# EAGLE design ledSkateBoard (EAGLE 7.2.0)
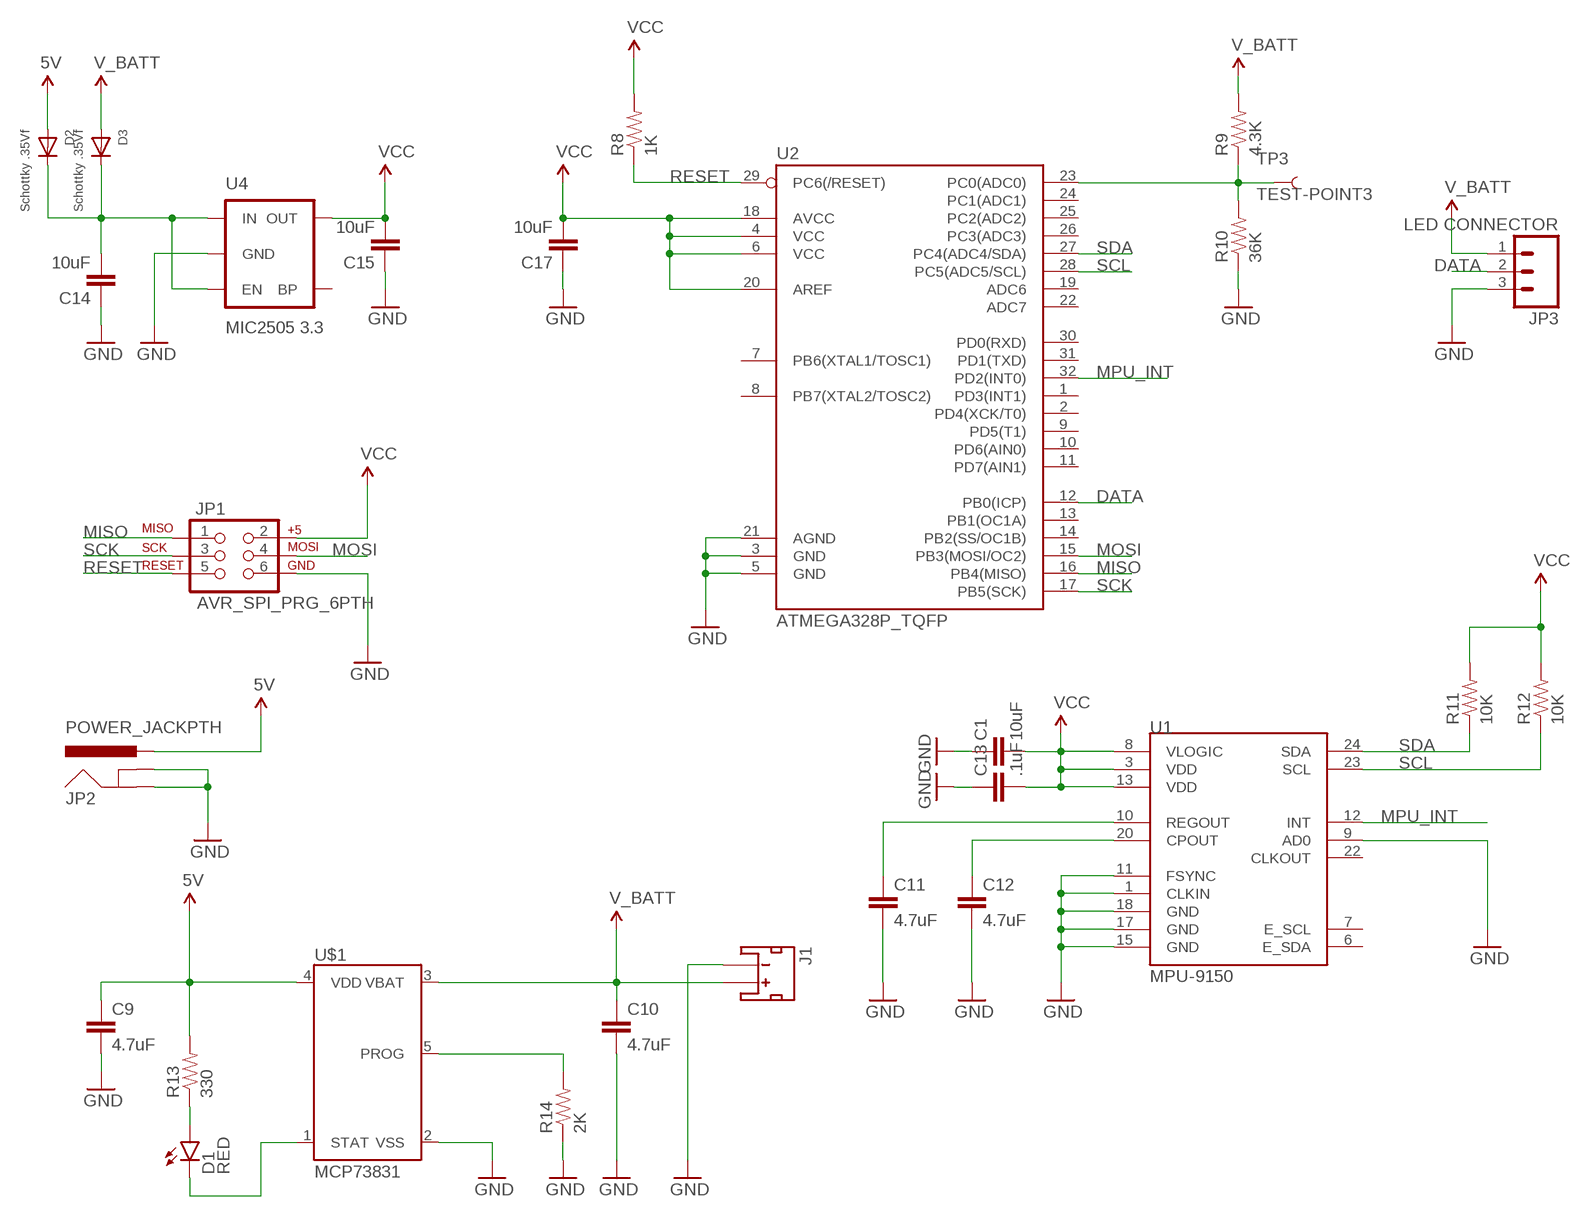
[diagram p0: schematic, sheet 1]

## Parts
C1  10uF  CAP0805  [0805]
C9  4.7uF  CAP0805  [0805]
C10  4.7uF  CAP0805  [0805]
C11  4.7uF  CAP0805  [0805]
C12  4.7uF  CAP0805  [0805]
C13  .1uF  CAP0805  [0805]
C14  10uF  CAP0805  [0805]
C15  10uF  CAP0805  [0805]
C17  10uF  CAP0805  [0805]
D1  RED  LED-RED0603  [LED-0603]
D2  Schottky .35Vf  DIODESMA  [SMADIODE]
D3  Schottky .35Vf  DIODESMA  [SMADIODE]
J1  JST  JST_2MM_MALE  [JST-2-SMD]
JP1  AVR_SPI_PRG_6PTH  [2X3]
JP2  POWER_JACKPTH  [POWER_JACK_PTH]
JP3  LED CONNECTOR  M03PTH  [1X03]
R8  1K  RESISTOR0805-RES  [0805]
R9  4.3K  RESISTOR0805-RES  [0805]
R10  36K  RESISTOR0805-RES  [0805]
R11  10K  RESISTOR0805-RES  [0805]
R12  10K  RESISTOR0805-RES  [0805]
R13  330  RESISTOR0805-RES  [0805]
R14  2K  RESISTOR0805-RES  [0805]
TP3  TEST-POINT3  [PAD.03X.03]
U1  MPU-9150  MPU-9150QFN-24-NP  [QFN-24-NP]
U2  ATMEGA328P_TQFP  [TQFP32-08]
U4  MIC2505 3.3  MIC52053.3V  [SOT23-5]
U$1  MCP73831  [SOT23-5]

## Nets
5V: C9.1 D2.A JP2.PWR R13.2 U$1.4(VDD)
DATA: JP3.2 U2.12(PB0(ICP))
GND: C1.1 C9.2 C10.2 C11.2 C12.2 C13.1 C14.1 C15.1 C17.1 J1.1(-) JP1.6 JP2.GND JP2.GNDBREAK JP3.3 R10.1 R14.1 U1.1(CLKIN) U1.9(AD0) U1.11(FSYNC) U1.15(GND) U1.17(GND) U1.18(GND) U2.3(GND) U2.5(GND) U2.21(AGND) U4.2(GND) U$1.2(VSS)
MISO: JP1.1 U2.16(PB4(MISO))
MOSI: JP1.4 U2.15(PB3(MOSI/OC2))
MPU_INT: U1.12(INT) U2.32(PD2(INT0))
N$1: C11.1 U1.10(REGOUT)
N$2: C12.1 U1.20(CPOUT)
N$3: C14.2 D2.C D3.C U4.1(IN) U4.3(EN)
N$4: R9.1 R10.2 TP3.P$1 U2.23(PC0(ADC0))
N$7: D1.A R13.1
N$8: D1.C U$1.1(STAT)
N$11: R14.2 U$1.5(PROG)
RESET: JP1.5 R8.1 U2.29(PC6(/RESET))
SCK: JP1.3 U2.17(PB5(SCK))
SCL: R12.1 U1.23(SCL) U2.28(PC5(ADC5/SCL))
SDA: R11.1 U1.24(SDA) U2.27(PC4(ADC4/SDA))
V_BATT: C10.1 D3.A J1.2(+) JP3.1 R9.2 U$1.3(VBAT)
VCC: C1.2 C13.2 C15.2 C17.2 JP1.2 R8.2 R11.2 R12.2 U1.3(VDD) U1.8(VLOGIC) U1.13(VDD) U2.4(VCC) U2.6(VCC) U2.18(AVCC) U2.20(AREF) U4.5(OUT)
Unconnected: J1.NC1(PAD1) J1.NC2(PAD2) U1.6(E_SDA) U1.7(E_SCL) U1.22(CLKOUT) U2.1(PD3(INT1)) U2.2(PD4(XCK/T0)) U2.7(PB6(XTAL1/TOSC1)) U2.8(PB7(XTAL2/TOSC2)) U2.9(PD5(T1)) U2.10(PD6(AIN0)) U2.11(PD7(AIN1)) U2.13(PB1(OC1A)) U2.14(PB2(SS/OC1B)) U2.19(ADC6) U2.22(ADC7) U2.24(PC1(ADC1)) U2.25(PC2(ADC2)) U2.26(PC3(ADC3)) U2.30(PD0(RXD)) U2.31(PD1(TXD)) U4.4(BP)

## Library data of the parts
C1 C9-C15 C17 = SparkFun-Capacitors:CAP: Capacitor Standard 0603 ceramic capacitor, and 0.1" leaded capacitor.
D1 = SparkFun-LED:LED-RED: Assorted Red LEDs LilyPad 1206- DIO-09912 1206- DIO-00809 0603- DIO-00819; PROD_ID: DIO-00819
D2 D3 = microbuilder:DIODE: Diode SMA Model Volts Amps Type Vf Vr Digikey # Notes SSA34-E3 40V 3A Schottky 480mV @ 3A 200uA @ 40V SSA34-E3/61TGITR-ND CDBA120-G 20V 1A Schottky 500mV @ 1A 500uA @ 20V 641-1014-6-ND REEL MBRA210 10V 2A Schottky 350mV @ 2A 700uA @ 10V MBRA210LT3 SOD-123 Model Volts Amps Type Vf Vr Order # Notes BAT54T1G 30V 200mA Schottky 800mV @ 200mA 2uA @ 25V BAT54T1GOSTR-ND B0530W 30V 500mA Schottky 430mV @ 500mA 130uA @ 30V B0530W-FDICT-ND REEL MBR120 1A 20V Schottky 340mV @ 1A MBR120VLSFT1GOSCT-ND SOD-323 Model Volts Amps Type Vf Vr Order # Notes PMEG2005EJ 20V 500mA Schottky 355mV @ 500mA 568-4110-1-ND ZLLS410 10V 570mA Schottky 380mV @ 570mA ZLLS410CT-ND 1N4148WS 75V 150mA Silicon/Simple 1V 1N4148WSFSCT-ND REEL SOD-523 Model Volts Amps Type Vf Vr Order # Notes BAT54XV2 30V 200mA Schottky 0.8V @ 100mA BAT54XV2CT-ND TB751S 30V 30mA Schottky RB751S-40TE61CT-ND SOT23-R/W (R = Solder Paste/Reflow Ovens, W = Hand-Soldering) Model Volts Amps Type Vf Vr Order # Notes BAT54FILM 40V 300mA Schottky 497-7162-1-ND
J1 = SparkFun-Connectors:JST_2MM_MALE: Mates to single-cell LiPo batteries. CONN-08352; PROD_ID: CONN-08352
JP1 = SparkFun-Connectors:AVR_SPI_PRG_6: AVR ISP 6 Pin This is the reduced ISP connector for AVR programming. Common on Arduino. This footprint will take up less PCB space and can be used with a 10-pin to 6-pin adapter such as SKU: BOB-08508 **Special note about "TEST_POINT" package. The stop mask is on the top side, so if you want your programming test points to be on the bottom of your board, make sure to place this package on the bottom side of the board. This also ensure that the orientation to program from the bottom side will be correct.
JP2 = SparkFun-Connectors:POWER_JACK: Power Jack This is the standard 5.5mm barrel jack for power. The PTH is the most common, proven, reliable, footprint. The Slot footprint only works if the mill layer is transmitted to the PCB fab house so be warned. Mating wall wart : TOL-00298 (and others); PROD_ID: CONN-08197
JP3 = SparkFun-Connectors:M03: Header 3 Standard 3-pin 0.1" header. Use with straight break away headers (SKU : PRT-00116), right angle break away headers (PRT-00553), swiss pins (PRT-00743), machine pins (PRT-00117), and female headers (PRT-00115). Molex polarized connector foot print use with SKU : PRT-08232 with associated crimp pins and housings.
R8-R14 = SparkFun-Resistors:RESISTOR: Resistor Basic schematic elements and footprints for 0603, 1206, and PTH resistors.
TP3 = SparkFun-Passives:TEST-POINT: Bare copper test points for troubleshooting or ICT
U1 = SparkFun-Sensors:MPU-9150: 9DOF (3mag, 3accel, 3rotat). I2C interface.
U2 = SparkFun-DigitalIC:ATMEGA328P_TQFP; PROD_ID: IC-09069
U4 = SparkFun-PowerIC:MIC5205: MIC5205 150mA vreg 3.3V - VREG-00822 5V - VREG-00823; PROD_ID: VREG-00822
U$1 = GeekAmmo:MCP73831: MCP73831 Miniature Single-Cell, Fully Integrated Li-Ion, Li-Polymer Charge Management Controllers The MCP73831/2 devices are highly advanced linear charge management controllers for use in spacelimited, cost-sensitive applications. http://ww1.microchip.com/downloads/en/DeviceDoc/20001984F.pdf

## Board
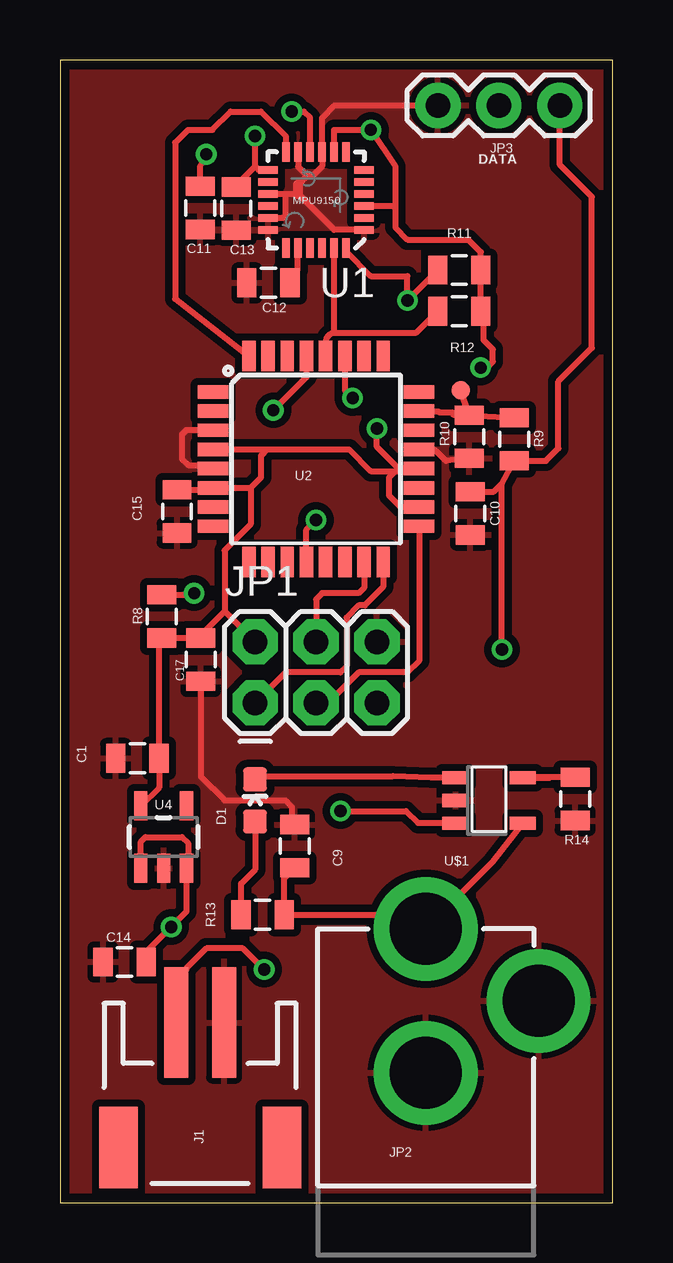
[diagram p1: board, top side]
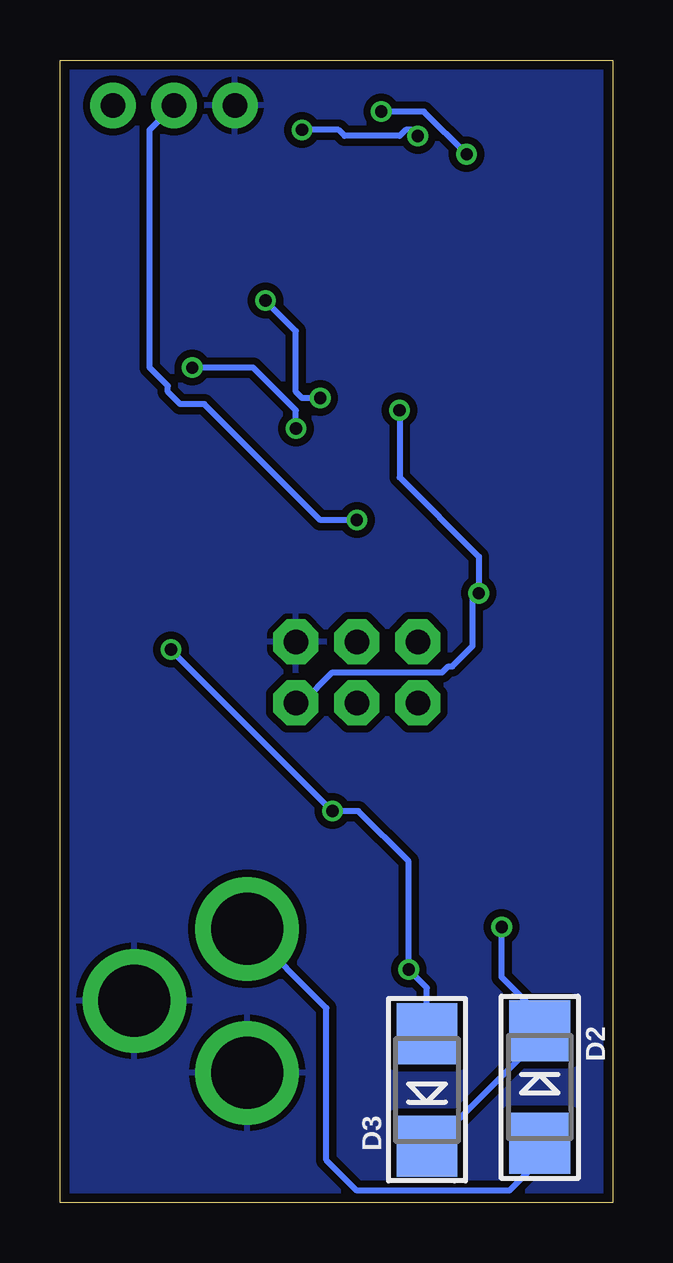
[diagram p2: board, bottom side, seen from below]

Size 23.04 x 47.62 mm. Coordinates in mm from the lower left corner, seen from the top.
Outline: 0,0 23.04,0 23.04,47.62 0,47.62 0,0
Copper layers (1*16): Top 0.0356mm / dielectric 1.5011mm / Bottom 0.0356mm
Design rules "OSHPARK": minimum track width 6mil, minimum drill 13mil, track to track 6mil, track to pad 6mil, pad to pad 6mil, via to via 6mil, smd to smd 6mil, copper to edge 15mil, drill to drill 6mil, minimum pad ring 7mil, minimum via ring 7mil, stop-mask expansion 3mil, vias tented up to drill 0mil, thermal gap 10mil

### Footprints (pad centres in the part's own frame; a part is rotated, then mirrored left to right if it is on the bottom)
0805 = smd 0.8 x 1.2: 1 -0.9,0; 2 0.9,0
LED-0603 = smd 1 x 1: A 0,-0.877; C 0,0.877
SMADIODE = smd 2.54 x 2.54: A 2.349,0; C -2.349,0
JST-2-SMD = smd 1 x 4.6: 1 -1,-3.7; 2 1,-3.7 | smd 1.6 x 3.4: NC1 -3.4,1.5; NC2 3.4,1.5
2X3 = drill 1.016 pad 1.88 octagon: 1 0,0; 2 0,2.54; 3 2.54,0; 4 2.54,2.54; 5 5.08,0; 6 5.08,2.54
POWER_JACK_PTH = drill 2.997 pad 4.318: GND 0,7.7; GNDBREAK 4.7,10.7; PWR 0,13.7
1X03 = drill 1.016 pad 1.88: 1 0,0; 2 2.54,0; 3 5.08,0
PAD.03X.03 = smd 0.762 x 0.762: P$1 0,0
QFN-24-NP = smd 0.8 x 0.3: 1 -2,1.25; 2 -2,0.75; 3 -2,0.25; 4 -2,-0.25; 5 -2,-0.75; 6 -2,-1.25; 13 2,-1.25; 14 2,-0.75; 15 2,-0.25; 16 2,0.25; 17 2,0.75; 18 2,1.25 | smd 0.3 x 0.8: 7 -1.25,-2; 8 -0.75,-2; 9 -0.25,-2; 10 0.25,-2; 11 0.75,-2; 12 1.25,-2; 19 1.25,2; 20 0.75,2; 21 0.25,2; 22 -0.25,2; 23 -0.75,2; 24 -1.25,2
TQFP32-08 = smd 1.27 x 0.559: 1 -4.293,2.8; 2 -4.293,2; 3 -4.293,1.2; 4 -4.293,0.4; 5 -4.293,-0.4; 6 -4.293,-1.2; 7 -4.293,-2; 8 -4.293,-2.8; 17 4.293,-2.8; 18 4.293,-2; 19 4.293,-1.2; 20 4.293,-0.4; 21 4.293,0.4; 22 4.293,1.2; 23 4.293,2; 24 4.293,2.8 | smd 0.559 x 1.27: 9 -2.8,-4.293; 10 -2,-4.293; 11 -1.2,-4.293; 12 -0.4,-4.293; 13 0.4,-4.293; 14 1.2,-4.293; 15 2,-4.293; 16 2.8,-4.293; 25 2.8,4.293; 26 2,4.293; 27 1.2,4.293; 28 0.4,4.293; 29 -0.4,4.293; 30 -1.2,4.293; 31 -2,4.293; 32 -2.8,4.293
SOT23-5 = smd 0.55 x 1.2: 1 -0.95,-1.3; 2 0,-1.3; 3 0.95,-1.3; 4 0.95,1.3; 5 -0.95,1.3
SOT23-5' = smd 0.55 x 1.1: 1 -0.95,-1.3; 2 0,-1.3; 3 0.95,-1.3; 4 0.95,1.5; 5 -0.95,1.5

### Placement (x,y rotation side)
C1  3.23,18.52 0 top
C9  9.78,14.86 90 top
C10  17.09,28.73 270 top
C11  5.84,41.45 270 top
C12  8.69,38.33 180 top
C13  7.34,41.43 90 top
C14  2.69,10.03 0 top
C15  4.88,28.8 90 top
C17  5.87,22.63 90 top
D1  8.13,16.76 0 top
D2  3.05,4.83 270 bottom
D3  7.75,4.7 90 bottom
J1  5.84,3.81 180 top
JP1  8.13,20.83 0 top
JP2  15.24,-2.29 0 top
JP3  20.83,45.72 180 top
R8  4.24,24.43 270 top
R9  18.92,31.81 270 top
R10  17.06,31.92 90 top
R11  16.64,38.86 0 top
R12  16.64,37.15 0 top
R13  8.45,12 0 top
R14  21.46,16.83 90 top
TP3  16.7,33.85 0 top
U1  10.67,41.78 180 top
U2  10.67,30.99 0 top
U4  4.32,15.24 0 top
U$1  MCP73831  [SOT23-5']  17.78,16.76 270 top

### Tracks (layer width: path | path; a pad name or v marks a point on that pad's centre or on a via)
5V
  Top 0.254: U$1.4 18.01,14.18 JP2.PWR 14.65,12 R13.2 9.35,13.53 C9.1
  Bottom 0.254: D2.A 3.05,1.78 4.32,0.51 10.67,0.51 11.94,1.78 11.94,8.11 JP2.PWR
DATA  (via drill 0.51)
  Top 0.254: U2.12 10.27,28.05 v10.67,28.45
  Bottom 0.254: v10.67,28.45 12.19,28.45 17.02,33.27 18.03,33.27 18.54,33.78 18.54,34.04 19.3,34.8 19.3,44.7 JP3.2
GND
  Top 0.254: 10.29,42.79 9.92,42.42 | U1.1 11.42,40.53 9.92,42.03 9.4,42.03 | U1.15 9.4,42.03 | U1.11 9.92,43.17 10.29,42.79 | 10.29,42.79 10.53,42.79 10.92,43.18 U1.9 10.92,45.21 11.43,45.72 JP3.3 | R10.1 16.08,30.91 15.62,31.37 14.98,31.37 U2.21 | C17.1 5.87,17.75 6.86,16.76 9.4,16.76 9.65,16.51 9.65,15.89 C9.2 | U1.17 9.28,41.03 9.4,41.15 9.4,42.03 | U2.3 5.26,32.19 5.08,32 5.08,30.99 5.33,30.73 6.23,30.73 U2.5
  Top 0.406: 9.92,42.03 9.92,42.42
  pour Top (isolate 0.305): 23.11,47.5 23.11,0 0,0 0,47.5
  pour Bottom (isolate 0.305): 0,47.5 23.11,47.5 23.11,0 0,0
MISO
  Top 0.254: U2.16 13.47,25.66 12.7,24.89 12.45,24.89 11.94,24.38 11.94,22.35 11.68,22.1 9.4,22.1 JP1.1
MOSI
  Top 0.254: U2.15 12.67,25.62 12.45,25.4 10.92,25.4 10.67,25.15 JP1.4
MPU_INT
  Top 0.254: U1.12 9.42,44.43 8.38,45.47 7.11,45.47 6.35,44.7 5.33,44.7 4.8,44.17 4.8,37.66 U2.32
N$1  (via drill 0.51)
  Top 0.254: U1.10 10.42,45.21 10.16,45.47 v9.65,45.47 | C11.1 5.84,43.18 v6.1,43.69
  Bottom 0.254: v6.1,43.69 7.87,45.47 v9.65,45.47
N$2
  Top 0.254: C12.1 9.59,38.54 9.91,38.86 9.91,39.77 U1.20
N$3  (via drill 0.51)
  Top 0.254: U4.1 3.37,15.05 3.56,15.24 5.08,15.24 5.33,14.99 5.33,14.01 U4.3 5.27,12.13 v4.64,11.49 3.59,10.45 C14.2
  Bottom 0.254: D3.C 7.56,2.35 3.05,6.86 D2.C 3.05,7.81 4.64,9.4 v4.64,11.49
N$4
  Top 0.254: U2.23 14.99,32.96 15.81,32.96 arc90 15.85,32.92 16.36,32.92 arc90 16.46,32.82 R10.2 | R10.2 TP3.P$1 | R10.2 R9.1
N$7
  Top 0.254: D1.A 8.13,13.88 7.55,13.3 R13.1
N$8
  Top 0.254: D1.C 8.13,17.78 13.87,17.78 15.46,17.71 U$1.1
N$11
  Top 0.254: 20.42,17.71 U$1.5 19.29,17.73 R14.2
RESET  (via drill 0.51)
  Top 0.254: U2.29 10.27,34.4 v8.89,33.02 | R8.1 5.52,25.34 v5.59,25.4
  Bottom 0.254: v8.89,33.02 8.89,30.23 5.59,26.92 v5.59,25.4 5.84,25.15 5.84,23.2 6.69,22.35 6.86,22.35 7.11,22.1 11.68,22.1 12.95,20.83 JP1.5
SCK
  Top 0.254: U2.17 14.96,22.58 14.48,22.1 12.45,22.1 11.43,21.08 10.92,21.08 JP1.3
SCL
  Top 0.254: U2.28 11.07,35.83 arc-90 11.49,36.26 | 11.49,36.26 14.85,36.26 R12.1 | 11.49,36.26 11.39,36.26 11.42,36.29 U1.23 11.39,39.76
SDA  (via drill 0.51)
  Top 0.254: U1.24 11.92,39.64 12.95,38.61 14.48,38.61 v14.48,37.59 14.54,37.66 R11.1 | U2.27 11.87,33.85 v12.19,33.53
  Bottom 0.254: v12.19,33.53 12.95,33.53 13.21,33.78 13.21,36.32 v14.48,37.59
V_BATT  (via drill 0.51)
  Top 0.254: U$1.3 14.92,15.81 14.41,16.32 v11.68,16.32 | v8.51,9.71 7.62,10.61 6.1,10.61 5.27,9.78 5.27,9.71 5.02,9.46 5.02,7.68 J1.2 | v18.41,23.05 18.41,29.96 | 18.41,29.96 R9.2 20.25,30.91 20.76,31.43 20.76,34.23 22.16,35.62 22.16,41.91 20.83,43.24 JP3.1 | C10.1 18.08,29.63 18.41,29.96
  Bottom 0.254: D3.A 7.75,8.95 v8.51,9.71 8.51,14.22 10.6,16.32 v11.68,16.32 v18.41,23.05
VCC  (via drill 0.51)
  Top 0.254: 11.42,44.69 11.43,44.7 | 11.43,44.7 v12.95,44.7 13.97,43.18 13.97,41.4 | 13.97,41.4 13.97,40.64 14.48,40.13 17.02,40.13 17.54,39.61 R11.2 R12.2 17.65,37.03 17.65,35.94 18.03,35.56 18.03,35.05 17.78,34.8 v17.53,34.8 | U1.13 8.27,43.03 8.13,43.18 | 8.13,43.18 v8.13,44.45 | U2.4 8.64,31.39 | 8.64,31.39 12.05,31.39 12.95,30.48 13.97,30.48 | 13.97,30.48 14.33,30.48 | 7.94,29.79 U2.6 6.29,29.7 C15.2 | 7.94,29.79 8.38,30.23 8.38,31.13 8.64,31.39 | 7.94,29.79 7.94,28.26 6.86,27.18 6.86,24.64 | 6.86,24.64 JP1.2 | U2.18 14.19,28.99 13.72,29.46 13.72,30.23 13.97,30.48 | U2.20 14.22,30.59 | 14.22,30.59 14.12,30.59 13.21,31.5 v13.21,32.26 | U1.8 11.43,43.8 11.43,44.7 | U1.3 13.84,41.53 arc-90 13.97,41.4 | 14.85,30.48 14.33,30.48 | 14.33,30.48 14.22,30.59 | C13.2 7.34,42.39 8.13,43.18 | 6.86,24.64 5.87,23.65 C17.2 R8.2 4.13,23.42 C1.2 4.13,17.3 U4.5
  Bottom 0.254: v8.13,44.45 8.38,44.7 8.64,44.7 8.89,44.45 11.18,44.45 11.43,44.7 v12.95,44.7 | v13.21,32.26 13.21,33.02 14.99,34.8 v17.53,34.8

### Text on the board
tNames: DATA | MPU9150